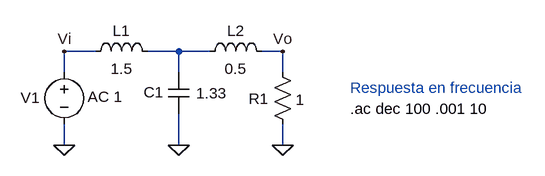
[diagram p0: schematic EJ2.asc]
EJ2.asc, the LTspice schematic file:
Version 4
SHEET 1 880 680
WIRE -448 176 -496 176
WIRE -320 176 -368 176
WIRE -272 176 -320 176
WIRE -160 176 -192 176
WIRE -496 208 -496 176
WIRE -320 208 -320 176
WIRE -160 208 -160 176
WIRE -496 320 -496 288
WIRE -320 320 -320 272
WIRE -160 320 -160 288
FLAG -320 320 0
FLAG -160 320 0
FLAG -496 320 0
FLAG -160 176 Vo
FLAG -496 176 Vi
SYMBOL voltage -496 192 R0
WINDOW 123 36 54 Left 2
WINDOW 39 0 0 Left 0
WINDOW 0 -67 55 Left 2
SYMATTR Value2 AC 1
SYMATTR InstName V1
SYMATTR Value ""
SYMBOL ind -464 192 R270
WINDOW 0 32 56 VTop 2
WINDOW 3 5 56 VBottom 2
SYMATTR InstName L1
SYMATTR Value 1.5
SYMBOL cap -336 208 R0
WINDOW 0 -38 31 Left 2
WINDOW 3 43 32 Left 2
SYMATTR InstName C1
SYMATTR Value 1.33
SYMBOL ind -288 192 R270
WINDOW 0 32 56 VTop 2
WINDOW 3 5 56 VBottom 2
SYMATTR InstName L2
SYMATTR Value 0.5
SYMBOL res -176 192 R0
WINDOW 0 -36 57 Left 2
WINDOW 3 36 58 Left 2
SYMATTR InstName R1
SYMATTR Value 1
TEXT -56 264 Left 2 !.ac dec 100 .001 10
TEXT -56 232 Left 2 ;Respuesta en frecuencia

The netlist it stands for:
* EJ2.asc
V1 Vi 0 AC 1
L1 Vi N001 1.5
C1 N001 0 1.33
L2 N001 Vo 0.5
R1 Vo 0 1
.ac dec 100 .001 10
* Respuesta en frecuencia
.backanno
.end